# EAGLE schematic Programmer Board v1 (EAGLE 7.2.0)
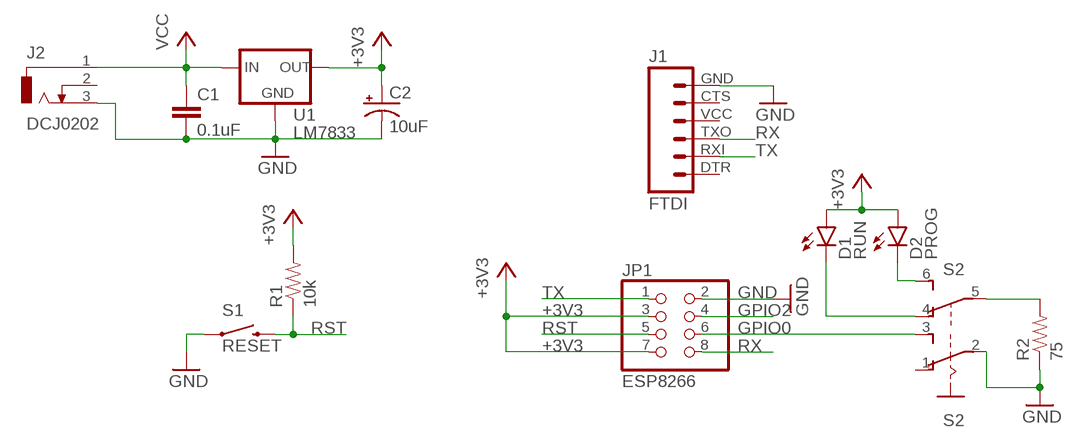
[diagram p0: schematic, sheet 1]

## Parts
C1  0.1uF  0.1UF-50V-20%(PTH)KIT-EZ  [CAP-PTH-SMALL-KIT]
C2  10uF  10UF-25V-20%(PTH)KIT  [CPOL-RADIAL-10UF-25V-KIT]
D1  RUN  LED3MM  [LED3MM]
D2  PROG  LED3MM  [LED3MM]
J1  FTDI  FTDI_BASICPTH  [FTDI_BASIC]
J2  DCJ0202  [DCJ0202]
JP1  ESP8266  PINHD-2X4  [2X04]
R1  10k  10KOHM-1/4W-1%(PTH)HORIZ  [AXIAL-0.3]
R2  75  10KOHM-1/4W-1%(PTH)HORIZ  [AXIAL-0.3]
S1  RESET  SWITCH-MOMENTARY-2PTH  [TACTILE-PTH]
S2  A68-A31  [A68-A31]
U1  LM7833  V_REG_78XX-TO-220  [TO-220-ALT]

## Nets
+3V3: C2.1(+) D1.A D2.A JP1.3 JP1.7 R1.P$2 U1.OUT
GND: C1.2 C2.2(-) J1.GND J2.3 JP1.2 R2.P$1 S1.1 S2.2(A:P) U1.GND
GPIO0: JP1.6 S2.3(A:S)
GPIO2: JP1.4
N$2: D2.K(C) S2.6(B:S)
N$3: D1.K(C) S2.4(B:O)
N$4: R2.P$2 S2.5(B:P)
RST: JP1.5 R1.P$1 S1.3
RX: J1.TXO JP1.8
TX: J1.RXI JP1.1
VCC: C1.1 J2.1 U1.IN
Unconnected: J1.CTS J1.DTR J1.VCC J2.2 S2.1(A:O)

## Library data of the parts
C1 = SparkFun-Capacitors:0.1UF-50V-20%(PTH): CAP-08370; PROD_ID: CAP-08370
C2 = SparkFun-Capacitors:10UF-25V-20%(PTH): CAP-08440; PROD_ID: CAP-08440
D1 D2 = SparkFun-LED:LED: LEDs Standard schematic elements and footprints for 5mm, 3mm, 1206, and 0603 sized LEDs. 5mm - Spark Fun Electronics SKU : COM-00529 (and others); PROD_ID: DIO-08794
J1 = SparkFun-Connectors:FTDI_BASIC: FTDI Basic header with labels
J2 = con-jack:DCJ0202: DC POWER JACK Source: DCJ0202.pdf; OC_FARNELL: unknown; OC_NEWARK: unknown
JP1 = adafruit:PINHD-2X4: PIN HEADER
R1 = SparkFun-Resistors:10KOHM-1/4W-1%(PTH): RES-12183; PROD_ID: RES-12183
R2 = SparkFun-Resistors:10KOHM-1/4W-1%(PTH): RES-12183; PROD_ID: RES-12183; VALUE: 10k
S1 = SparkFun-Electromechanical:SWITCH-MOMENTARY-2: Various NO switches- pushbuttons, reed, etc; PROD_ID: SWCH-08441
S2 = switch:A68-A31: SLIDING SWITCH Siemens, distributor Buerklin, 11G766
U1 = SparkFun-PowerIC:V_REG_78XX: Voltage Regulator Standard 78xx regulator. IGO (Input Ground Output). Spark Fun Electronics SKU : COM-00107; PROD_ID: VREG-08450; SF_ID: COM-00107